# Altium schematic sheet SMPS-3V.SchDoc
size A
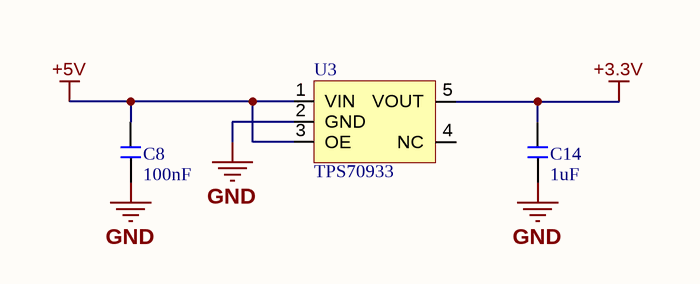
[diagram p0: SMPS-3V.SchDoc]

## Parts
C8  100nF  [C0603_N]
C14  1uF  [C0603_N]
U3  TPS70933  [SOT23-5_N]

## Nets
+3.3V: C14.1 U3.5(VOUT)
+5V: C8.1 U3.1(VIN) U3.3(OE)
GND: C8.2 C14.2 U3.2(GND)

Not connected (* = marked no-connect by the designer): U3 4(NC)

## Library data of the parts
C8 C14 = Capacitor: Capacitor MLCC; Manufacturer: Yageo; Manufacturer Part Number: CC0603KRX7R9BB104; Tolerance (%): 10; Category: Capacitor; Package: 0603; Supplier Part Number 1: 1362556; Supplier 1: Farnell; ComponentLink1URL: http://www.yageo.com; ComponentLink1Description: Manufacturer Website; Voltage Rating (Volts): *; Supplier 2: Digi-Key; Supplier Part Number 2: 311-1344-1-ND
  C8: Value: 100nF
  C14: Value: 1uF
U3 = XC6222